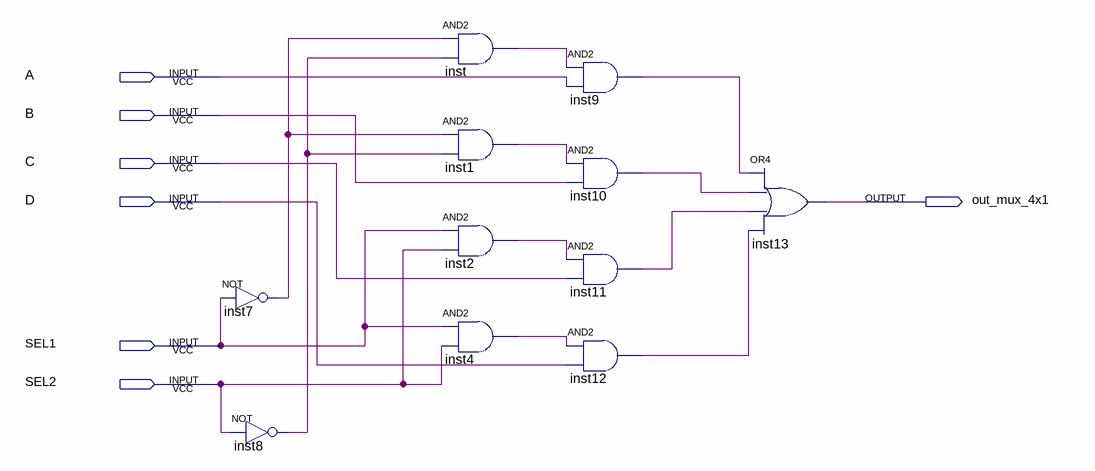
[diagram p0: schematic sheet]
// Quartus schematic mux_4x1.bdf as structural Verilog: 11 symbols, 7 pins
module mux_4x1 (
  input  A,
  input  B,
  input  C,
  input  D,
  input  SEL1,
  input  SEL2,
  output out_mux_4x1
);

  wire inst1_out, inst2_out, inst4_out, inst7_out, inst8_out, inst9_out, inst10_out, inst11_out, inst12_out,
       inst_out;

  not inst7 (inst7_out, SEL1);
  not inst8 (inst8_out, SEL2);
  and inst (inst_out, inst7_out, inst8_out);
  and inst1 (inst1_out, inst7_out, inst8_out);
  and inst2 (inst2_out, SEL1, SEL2);
  and inst4 (inst4_out, SEL1, SEL2);
  and inst9 (inst9_out, inst_out, A);
  and inst10 (inst10_out, inst1_out, B);
  and inst11 (inst11_out, inst2_out, C);
  and inst12 (inst12_out, inst4_out, D);
  or inst13 (out_mux_4x1, inst9_out, inst10_out, inst11_out, inst12_out);
endmodule
